# EAGLE schematic rom_programmer (EAGLE 7.4.0)
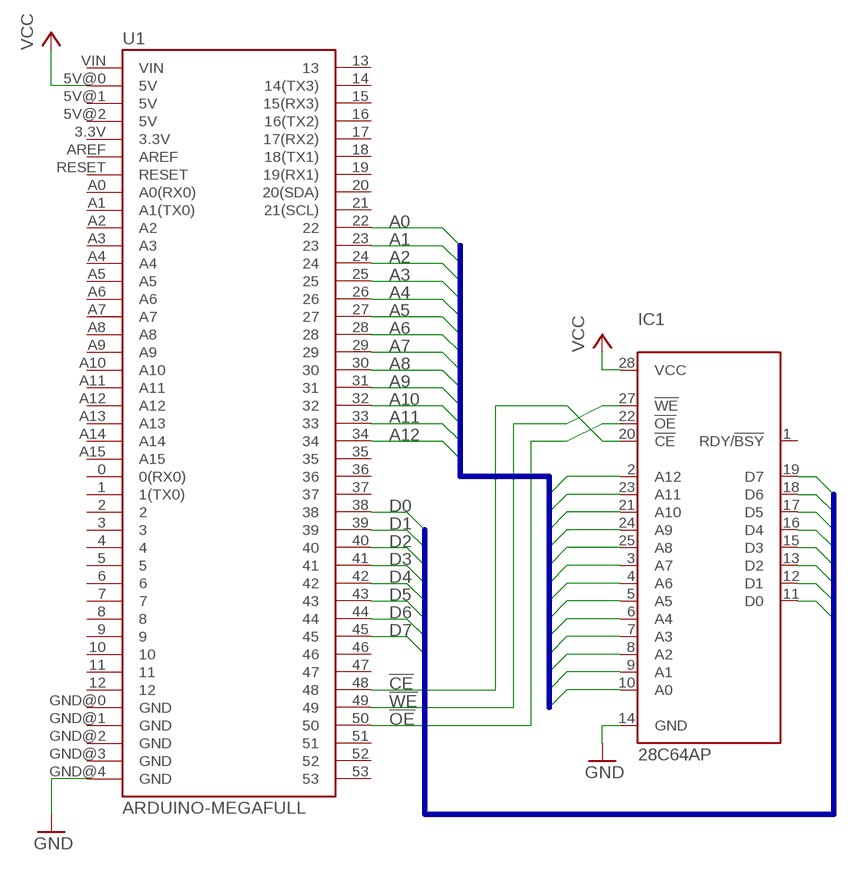
[diagram p0: schematic, sheet 1]

## Parts
IC1  28C64AP  [DIL28-6]
U1  ARDUINO-MEGAFULL  [ARDUINO_MEGA]

## Nets
!CE: IC1.20(!CE) U1.48
!OE: IC1.22(!OE) U1.50
!WE: IC1.27(!WE) U1.49
A0: U1.22
A1: U1.23
A2: U1.24
A3: U1.25
A4: U1.26
A5: U1.27
A6: U1.28
A7: U1.29
A8: U1.30
A9: U1.31
A10: U1.32
A11: U1.33
A12: U1.34
D0: U1.38
D1: U1.39
D2: U1.40
D3: U1.41
D4: U1.42
D5: U1.43
D6: U1.44
D7: U1.45
GND: IC1.14(GND) U1.GND@4(GND)
N$9: IC1.19(D7)
N$10: IC1.18(D6)
N$11: IC1.17(D5)
N$12: IC1.16(D4)
N$13: IC1.15(D3)
N$14: IC1.13(D2)
N$15: IC1.12(D1)
N$16: IC1.11(D0)
N$18: IC1.2(A12)
N$19: IC1.23(A11)
N$20: IC1.21(A10)
N$21: IC1.24(A9)
N$22: IC1.25(A8)
N$23: IC1.3(A7)
N$24: IC1.4(A6)
N$25: IC1.5(A5)
N$26: IC1.6(A4)
N$27: IC1.7(A3)
N$28: IC1.8(A2)
N$29: IC1.9(A1)
N$30: IC1.10(A0)
VCC: IC1.28(VCC) U1.5V@0(5V)
Unconnected: IC1.1(RDY/!BSY) U1.0(0(RX0)) U1.1(1(TX0)) U1.2 U1.3 U1.3.3V U1.4 U1.5 U1.5V@1(5V) U1.5V@2(5V) U1.6 U1.7 U1.8 U1.9 U1.10 U1.11 U1.12 U1.13 U1.14(14(TX3)) U1.15(15(RX3)) U1.16(16(TX2)) U1.17(17(RX2)) U1.18(18(TX1)) U1.19(19(RX1)) U1.20(20(SDA)) U1.21(21(SCL)) U1.35 U1.36 U1.37 U1.46 U1.47 U1.51 U1.52 U1.53 U1.A0(A0(RX0)) U1.A1(A1(TX0)) U1.A2 U1.A3 U1.A4 U1.A5 U1.A6 U1.A7 U1.A8 U1.A9 U1.A10 U1.A11 U1.A12 U1.A13 U1.A14 U1.A15 U1.AREF U1.GND@0(GND) U1.GND@1(GND) U1.GND@2(GND) U1.GND@3(GND) U1.RESET U1.VIN

## Buses
B$1
B$2

## Library data of the parts
IC1 = microchip:28*64A: CMOS EEPROM 64 K (8 K x 8), low voltage; MPN: AT28C64B-15PU; OC_FARNELL: 1631144; OC_NEWARK: 96K6557
U1 = SparkFun-Boards:ARDUINO-MEGA: Arduino Mega board footprint